# EAGLE schematic main (EAGLE 9.6.2)
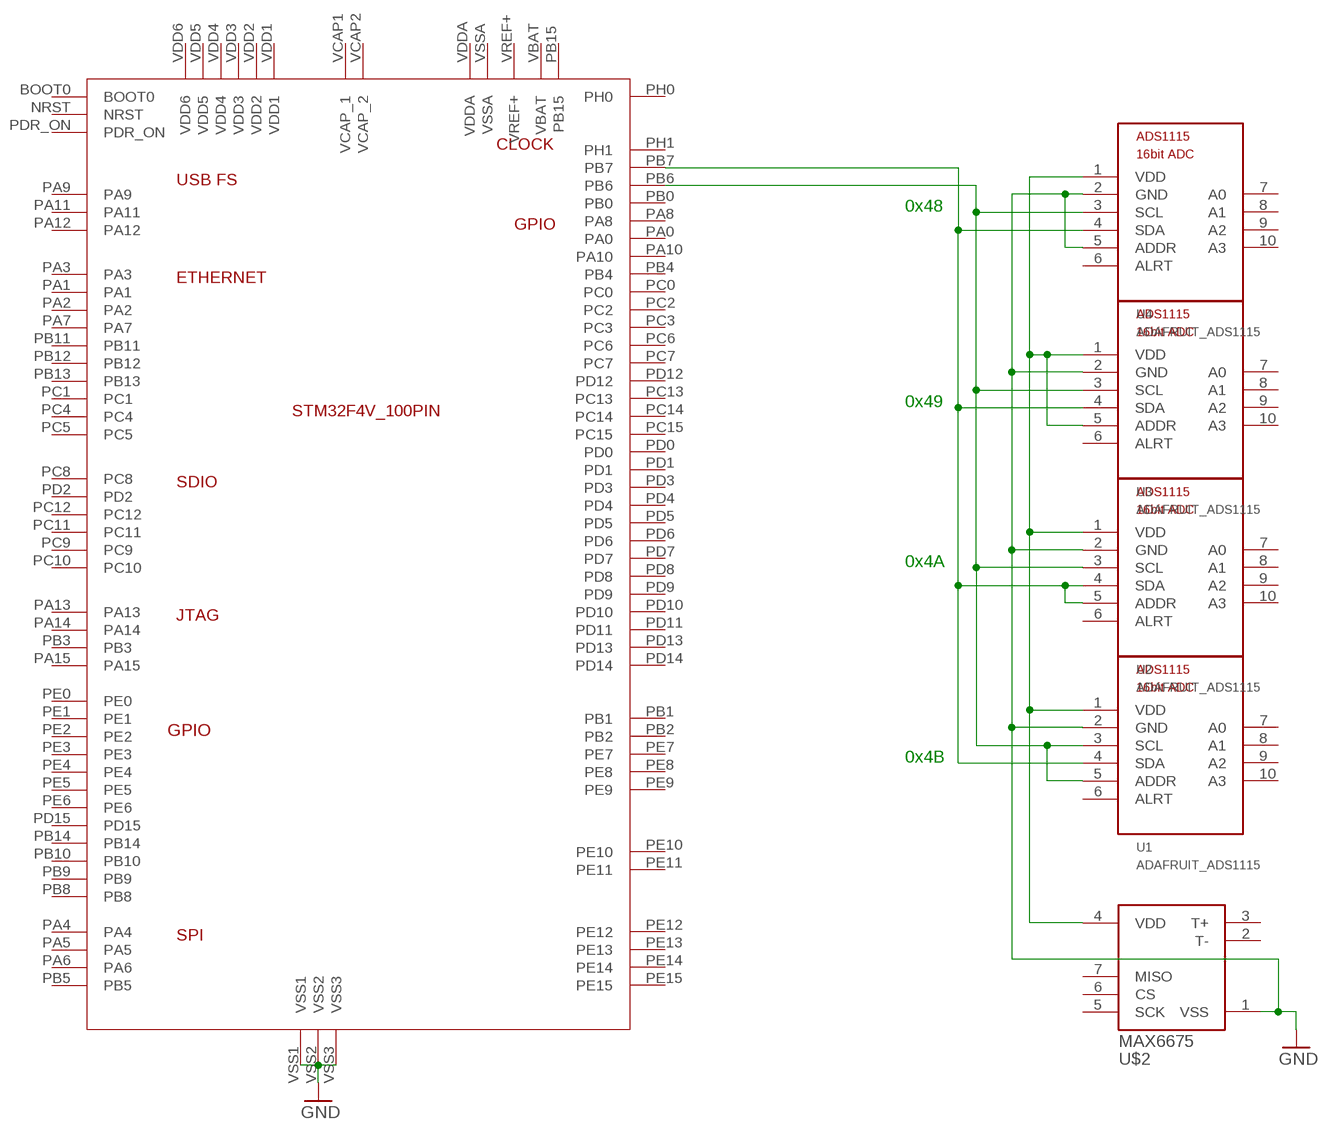
[diagram p0: schematic, sheet 1]

## Parts
U1  ADAFRUIT_ADS1115  [ADAFRUIT_ADS1115_16BIT_I2C_ADC]
U2  ADAFRUIT_ADS1115  [ADAFRUIT_ADS1115_16BIT_I2C_ADC]
U3  ADAFRUIT_ADS1115  [ADAFRUIT_ADS1115_16BIT_I2C_ADC]
U4  ADAFRUIT_ADS1115  [ADAFRUIT_ADS1115_16BIT_I2C_ADC]
U$1  STM32F4V_100PIN_GPSBOARD  [LQFP100]
U$2  MAX6675  [SO08]

## Nets
GND: U1.2(GND) U2.2(GND) U3.2(GND) U4.2(GND) U4.5(ADDR) U$1.VSS1 U$1.VSS2 U$1.VSS3 U$2.1(VSS)
N$1: U1.4(SDA) U2.4(SDA) U2.5(ADDR) U3.4(SDA) U4.4(SDA) U$1.PB7
N$2: U1.1(VDD) U2.1(VDD) U3.1(VDD) U3.5(ADDR) U4.1(VDD) U$2.4(VDD)
N$3: U1.3(SCL) U1.5(ADDR) U2.3(SCL) U3.3(SCL) U4.3(SCL) U$1.PB6
Unconnected: U1.6(ALRT) U1.7(A0) U1.8(A1) U1.9(A2) U1.10(A3) U2.6(ALRT) U2.7(A0) U2.8(A1) U2.9(A2) U2.10(A3) U3.6(ALRT) U3.7(A0) U3.8(A1) U3.9(A2) U3.10(A3) U4.6(ALRT) U4.7(A0) U4.8(A1) U4.9(A2) U4.10(A3) U$1.BOOT0 U$1.NRST U$1.PA0 U$1.PA1 U$1.PA2 U$1.PA3 U$1.PA4 U$1.PA5 U$1.PA6 U$1.PA7 U$1.PA8 U$1.PA9 U$1.PA10 U$1.PA11 U$1.PA12 U$1.PA13 U$1.PA14 U$1.PA15 U$1.PB0 U$1.PB1 U$1.PB2 U$1.PB3 U$1.PB4 U$1.PB5 U$1.PB8 U$1.PB9 U$1.PB10 U$1.PB11 U$1.PB12 U$1.PB13 U$1.PB14 U$1.PB15 U$1.PC0 U$1.PC1 U$1.PC2 U$1.PC3 U$1.PC4 U$1.PC5 U$1.PC6 U$1.PC7 U$1.PC8 U$1.PC9 U$1.PC10 U$1.PC11 U$1.PC12 U$1.PC13 U$1.PC14 U$1.PC15 U$1.PD0 U$1.PD1 U$1.PD2 U$1.PD3 U$1.PD4 U$1.PD5 U$1.PD6 U$1.PD7 U$1.PD8 U$1.PD9 U$1.PD10 U$1.PD11 U$1.PD12 U$1.PD13 U$1.PD14 U$1.PD15 U$1.PDR_ON U$1.PE0 U$1.PE1 U$1.PE2 U$1.PE3 U$1.PE4 U$1.PE5 U$1.PE6 U$1.PE7 U$1.PE8 U$1.PE9 U$1.PE10 U$1.PE11 U$1.PE12 U$1.PE13 U$1.PE14 U$1.PE15 U$1.PH0 U$1.PH1 U$1.VBAT U$1.VCAP1(VCAP_1) U$1.VCAP2(VCAP_2) U$1.VDDA U$1.VREF+ U$1.VSSA U$2.2(T-) U$2.3(T+) U$2.5(SCK) U$2.6(CS) U$2.7(MISO)

## Notes on the sheet
- 0x48
- 0x49
- 0x4A
- 0x4B

## Power pins joined to a net without a drawn wire
VDD1: U$1.VDD1
VDD2: U$1.VDD2
VDD3: U$1.VDD3
VDD4: U$1.VDD4
VDD5: U$1.VDD5
VDD6: U$1.VDD6

## Library data of the parts
U1-U4 = AD convertor:ADAFRUIT_ADS1115
U$1 = stm32f4:STM32F4V_100PIN_GPSBOARD: Custom symbol of 100-pin STM32F407 for GPS RF front-end board. Standard LQFP100 package.
U$2 = max6675:MAX6675